# EAGLE schematic chargerDischarger.V6 (EAGLE 9.5.1)
DESIGNER: Juan J. Rojas; INSTITUTION: Kyushu Institute of Technology; PROJECT_NAME: Charger/Discharger; VERSION: 5

## Sheet 1 of 2
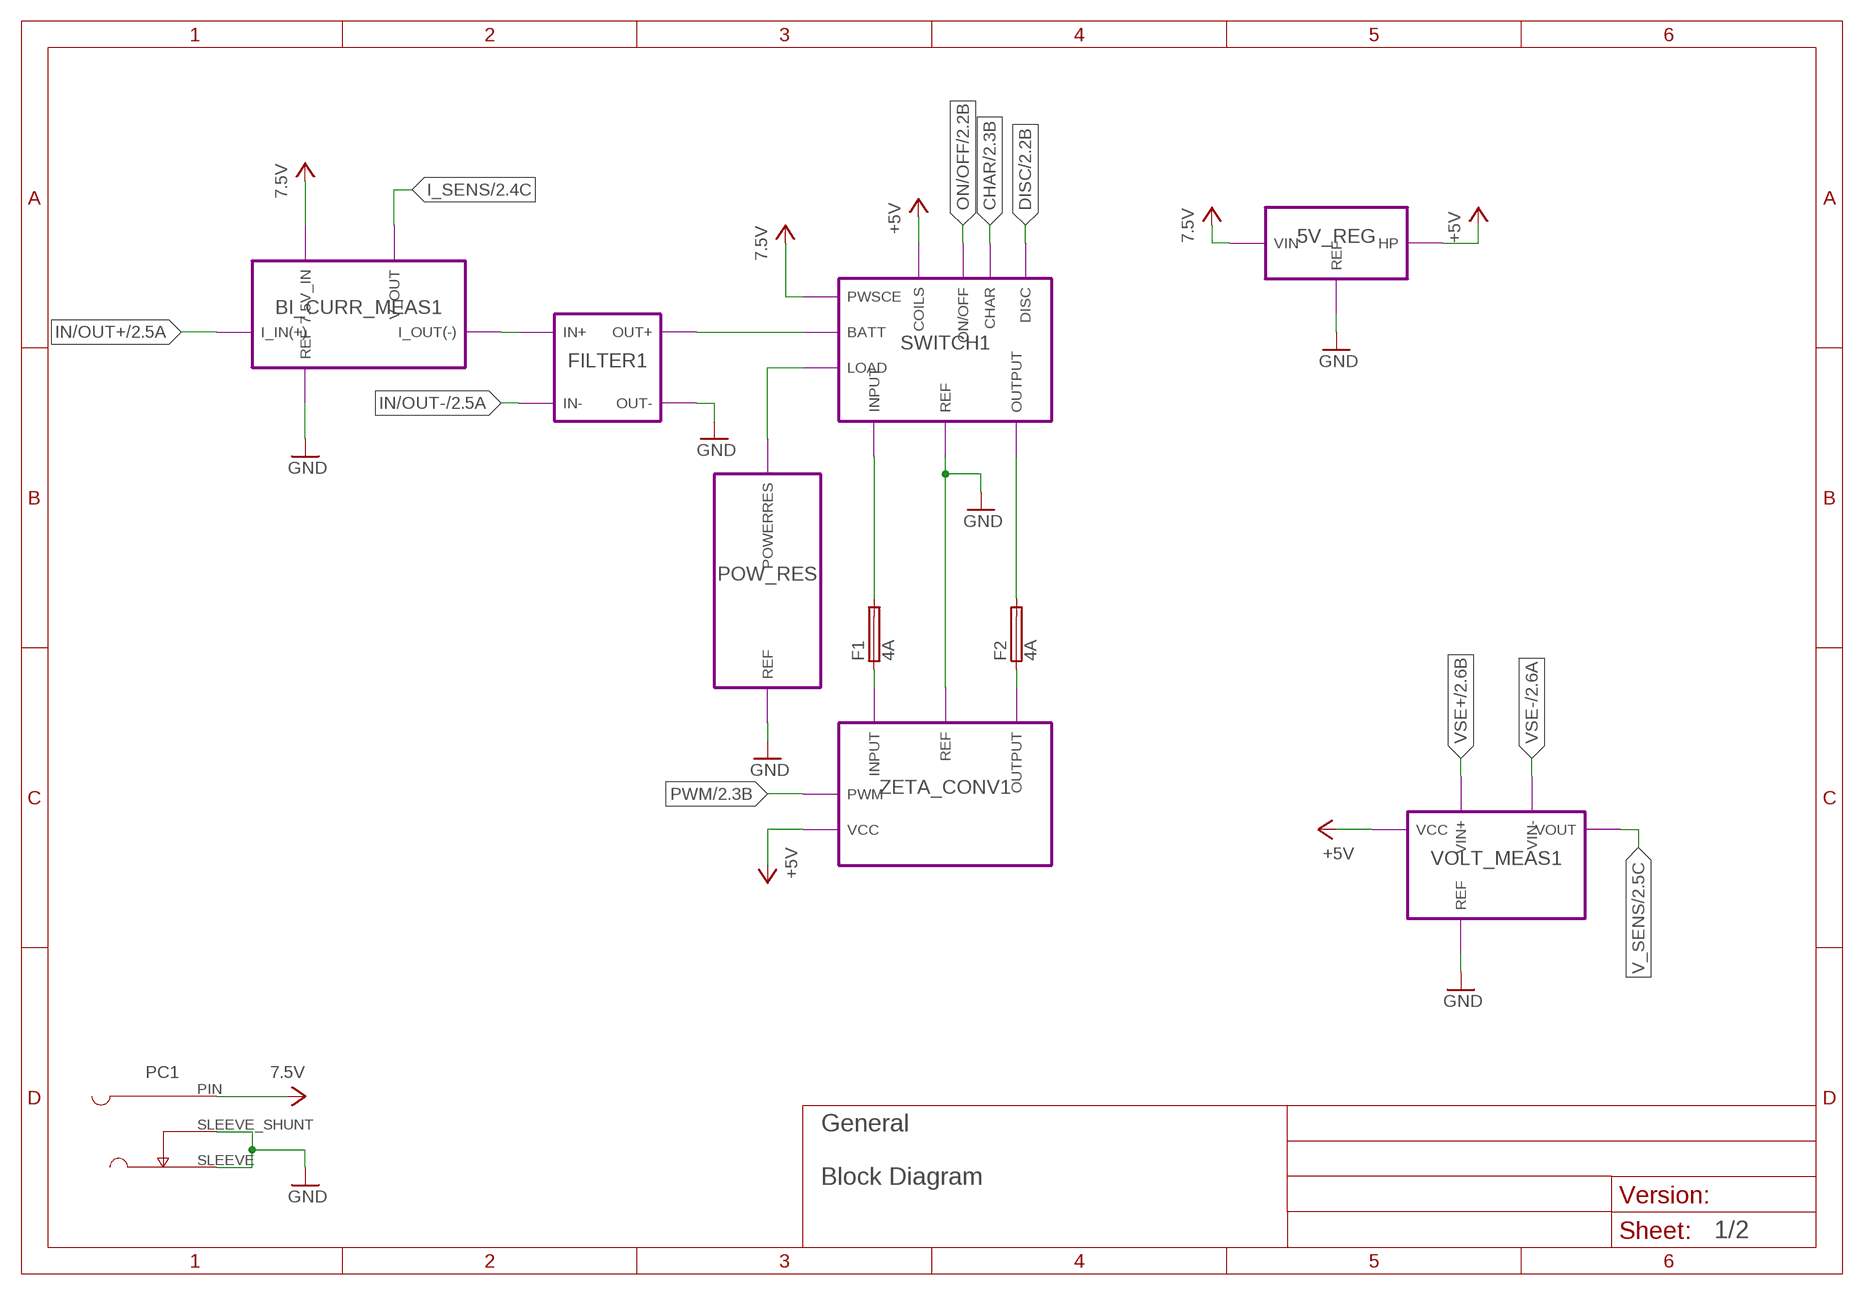
[diagram p0: schematic, sheet 1]
FRAME1 (A4L-JUANJO): SUBTITLE: Block Diagram; TITLE: General

### Parts
F1  4A  FUSEHOLDER  [SH22,5]
F2  4A  FUSEHOLDER  [SH22,5]
PC1  722RA  [722RA]

### Module instances
SWITCH1 = SWITCH (part numbers offset by 100)
ZETA_CONV1 = ZETA_CONVERTER (part numbers offset by 200)
5V_REG = 5V_REGULATION (part numbers offset by 400)
VOLT_MEAS1 = VOLTAGE_MEAS (part numbers offset by 500)
BI_CURR_MEAS1 = BI_CURR_MEAS (part numbers offset by 300)
FILTER1 = FILTER (part numbers offset by 600)
POW_RES = POWER_RESISTOR (part numbers offset by 700)

### Nets
7.5V: PC1.PIN ; port SWITCH1.PWSCE 5V_REG.VIN BI_CURR_MEAS1.7.5V_IN ; also sheet 2
+5V: port SWITCH1.COILS 5V_REG.HP ZETA_CONV1.VCC VOLT_MEAS1.VCC ; also sheet 2
CHAR: port SWITCH1.CHAR ; also sheet 2
DISC: port SWITCH1.DISC ; also sheet 2
GND: PC1.SLEEVE PC1.SLEEVE_SHUNT ; port 5V_REG.REF ZETA_CONV1.REF SWITCH1.REF VOLT_MEAS1.REF BI_CURR_MEAS1.REF FILTER1.OUT- POW_RES.REF ; also sheet 2
I_SENS: port BI_CURR_MEAS1.V_OUT ; also sheet 2
IN/OUT+: port BI_CURR_MEAS1.I_IN(+) ; also sheet 2
IN/OUT-: port FILTER1.IN- ; also sheet 2
N$6: port BI_CURR_MEAS1.I_OUT(-) FILTER1.IN+
N$7: port FILTER1.OUT+ SWITCH1.BATT
N$10: F1.2 ; port SWITCH1.INPUT
N$11: F2.2 ; port SWITCH1.OUTPUT
ON/OFF: port SWITCH1.ON/OFF ; also sheet 2
POWER_RESISTOR: port SWITCH1.LOAD POW_RES.POWERRES
PWM: port ZETA_CONV1.PWM ; also sheet 2
V_SENS: port VOLT_MEAS1.VOUT ; also sheet 2
VSE+: port VOLT_MEAS1.VIN+ ; also sheet 2
VSE-: port VOLT_MEAS1.VIN- ; also sheet 2
ZETA_IN: F1.1 ; port ZETA_CONV1.INPUT
ZETA_OUT: F2.1 ; port ZETA_CONV1.OUTPUT

## Sheet 2 of 2
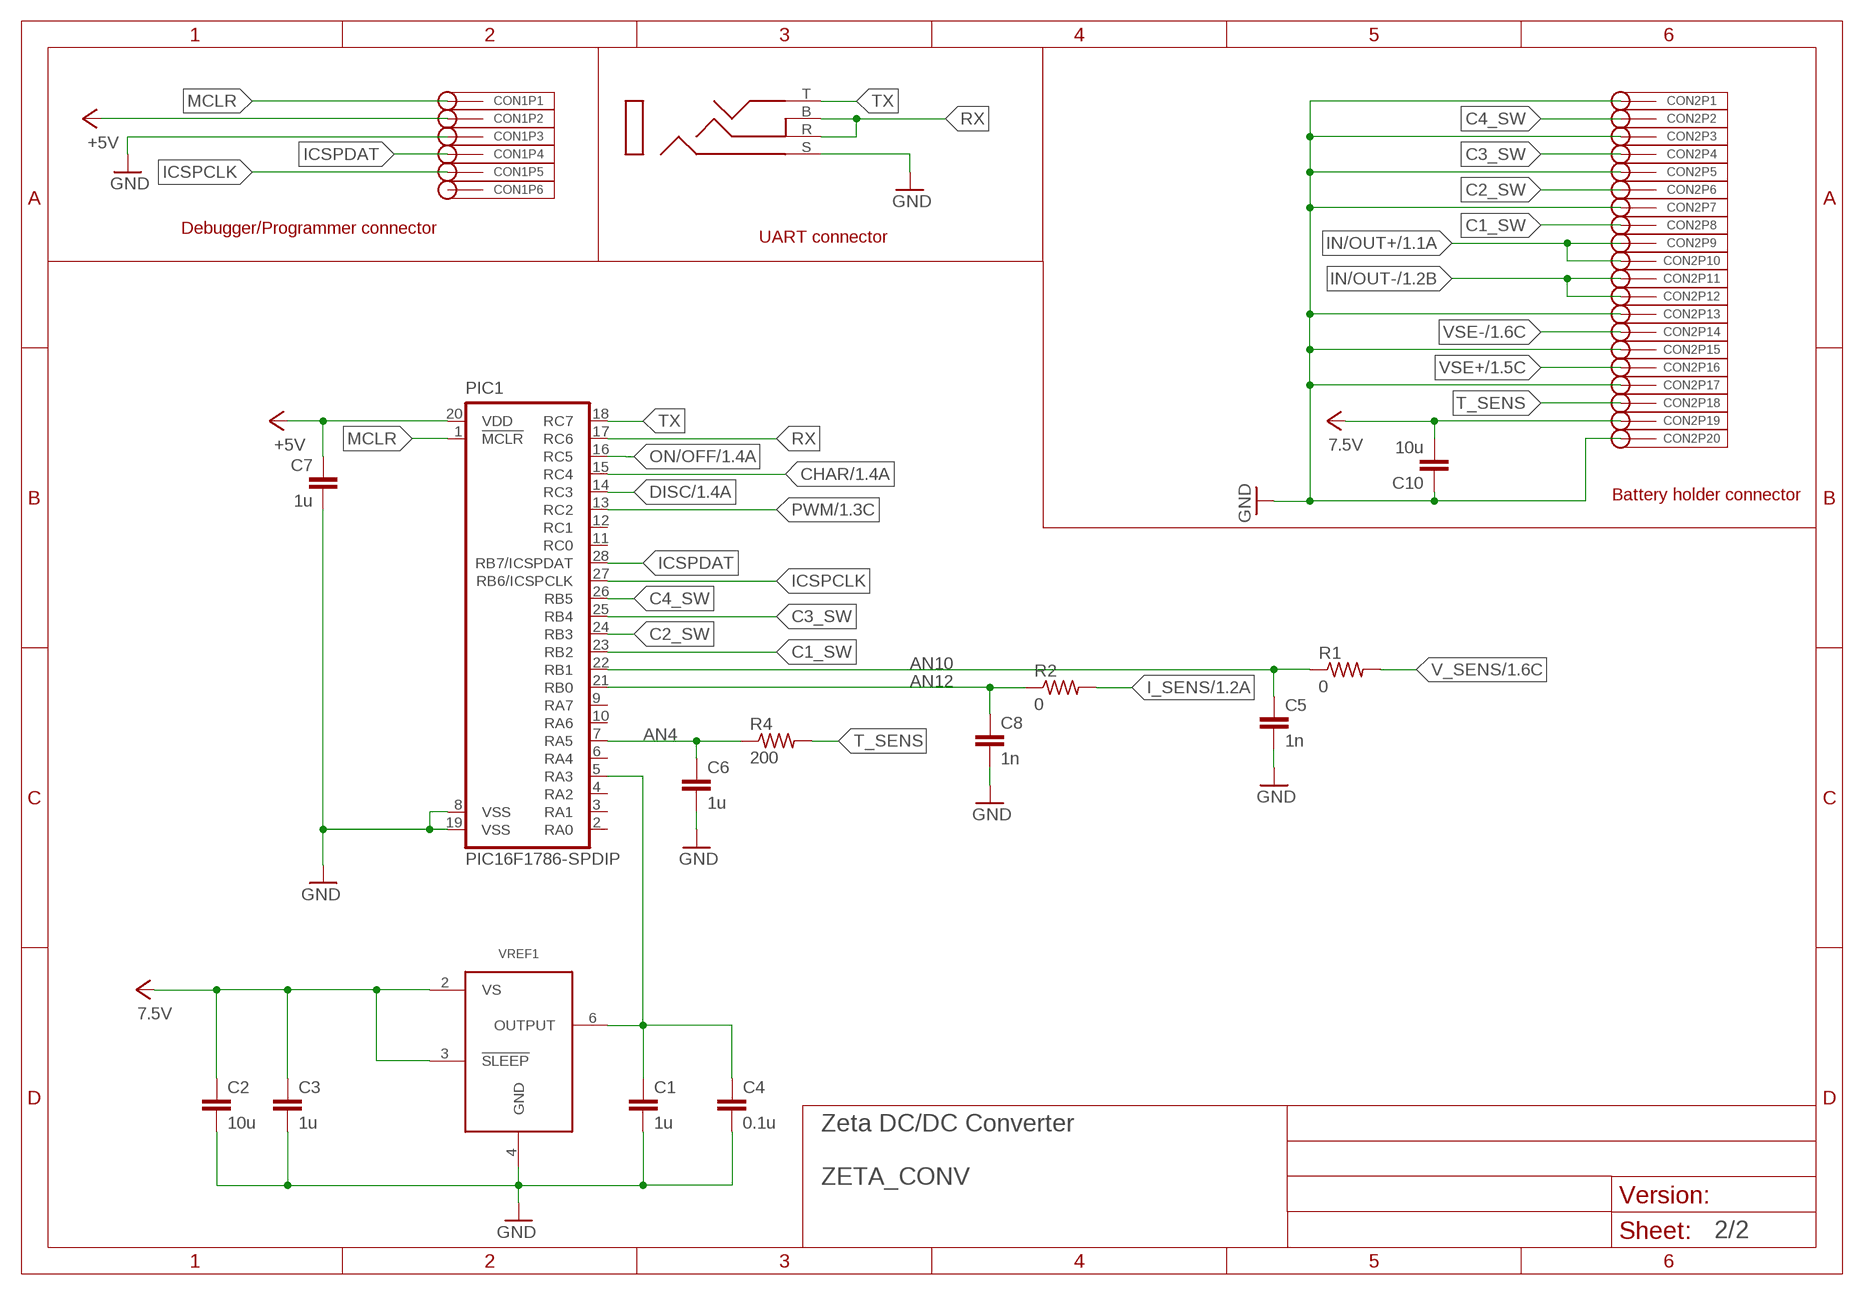
[diagram p1: schematic, sheet 2]
FRAME2 (A4L-JUANJO): SUBTITLE: ZETA_CONV; TITLE: Zeta DC/DC Converter

### Parts
C1  1u  NONPOL_CAP-0603  [C0603]
C2  10u  NONPOL_CAP-0603  [C0603]
C3  1u  NONPOL_CAP-0603  [C0603]
C4  0.1u  NONPOL_CAP-0603  [C0603]
C5  1n  NONPOL_CAP-0603  [C0603]
C6  1u  NONPOL_CAP-0603  [C0603]
C7  1u  NONPOL_CAP-0603  [C0603]
C8  1n  NONPOL_CAP-0603  [C0603]
C10  10u  NONPOL_CAP-0603  [C0603]
COMM  AUDIO_JACK-3.5MM  [KLBR4]
CON1  B6B-EH-A  [B6B-EH-A]
CON2  SQT-110-01-F-D-RA  [SQT-110-01-F-D-RA]
PIC1  PIC16F1786-SPDIP  [SPDIP-28]
R1  0  RESISTOR-0603  [R0603]
R2  0  RESISTOR-0603  [R0603]
R4  200  RESISTOR-0603  [R0603]
VREF1  REF195GSZ  [SOIC-8]

### Nets
7.5V: C2.1 C3.1 C10.2 CON2.19 VREF1.2(VS) VREF1.3(!SLEEP!) ; also sheet 1
+5V: C7.1 CON1.2 PIC1.20(VDD) ; also sheet 1
C1_SW: CON2.8 PIC1.23(RB2)
C2_SW: CON2.6 PIC1.24(RB3)
C3_SW: CON2.4 PIC1.25(RB4)
C4_SW: CON2.2 PIC1.26(RB5)
CHAR: PIC1.15(RC4) ; also sheet 1
DISC: PIC1.14(RC3) ; also sheet 1
GND: C1.2 C2.2 C3.2 C4.2 C5.2 C6.2 C7.2 C8.2 C10.1 COMM.S CON1.3 CON2.1 CON2.3 CON2.5 CON2.7 CON2.13 CON2.15 CON2.17 CON2.20 PIC1.8(VSS) PIC1.19(VSS) VREF1.4(GND) ; also sheet 1
I_SENS: R2.2 ; also sheet 1
ICSPCLK: CON1.5 PIC1.27(RB6/ICSPCLK)
ICSPDAT: CON1.4 PIC1.28(RB7/ICSPDAT)
IN/OUT+: CON2.9 CON2.10 ; also sheet 1
IN/OUT-: CON2.11 CON2.12 ; also sheet 1
MCLR: CON1.1 PIC1.1(!MCLR)
N$1: C8.1 PIC1.21(RB0) R2.1
N$2: C5.1 PIC1.22(RB1) R1.1
N$3: C6.1 PIC1.7(RA5) R4.1
N$4: C1.1 C4.1 PIC1.5(RA3) VREF1.6(OUTPUT)
ON/OFF: PIC1.16(RC5) ; also sheet 1
PWM: PIC1.13(RC2) ; also sheet 1
RX: COMM.B COMM.R PIC1.17(RC6)
T_SENS: CON2.18 R4.2
TX: COMM.T PIC1.18(RC7)
V_SENS: R1.2 ; also sheet 1
VSE+: CON2.16 ; also sheet 1
VSE-: CON2.14 ; also sheet 1
Unconnected: CON1.6 PIC1.2(RA0) PIC1.3(RA1) PIC1.4(RA2) PIC1.6(RA4) PIC1.9(RA7) PIC1.10(RA6) PIC1.11(RC0) PIC1.12(RC1)

### Notes on the sheet
- Debugger/Programmer connector
- UART connector
- Battery holder connector
- AN10
- AN12
- AN4

## Library data of the parts
C1-C8 C10 = Pasives:NONPOL_CAP
COMM = Interfaces:AUDIO_JACK-3.5MM
CON1 = Interfaces:B6B-EH-A
CON2 = Interfaces:SQT-110-01-F-D-RA
F1 F2 = Pasives:FUSEHOLDER: FUSE HOLDER grid 22,5 mm, OGN0031 8201, Schurter (Buerklin); MF: SCHURTER; MPN: 0031.8201
PC1 = Interfaces:722RA
PIC1 = ICs:PIC16F1786
R1 R2 R4 = Pasives:RESISTOR: RESISTOR
VREF1 = ICs:REF195GSZ

## Module ZETA_CONVERTER
Ports: INPUT(io) OUTPUT(io) REF(io) PWM(io) VCC(io)
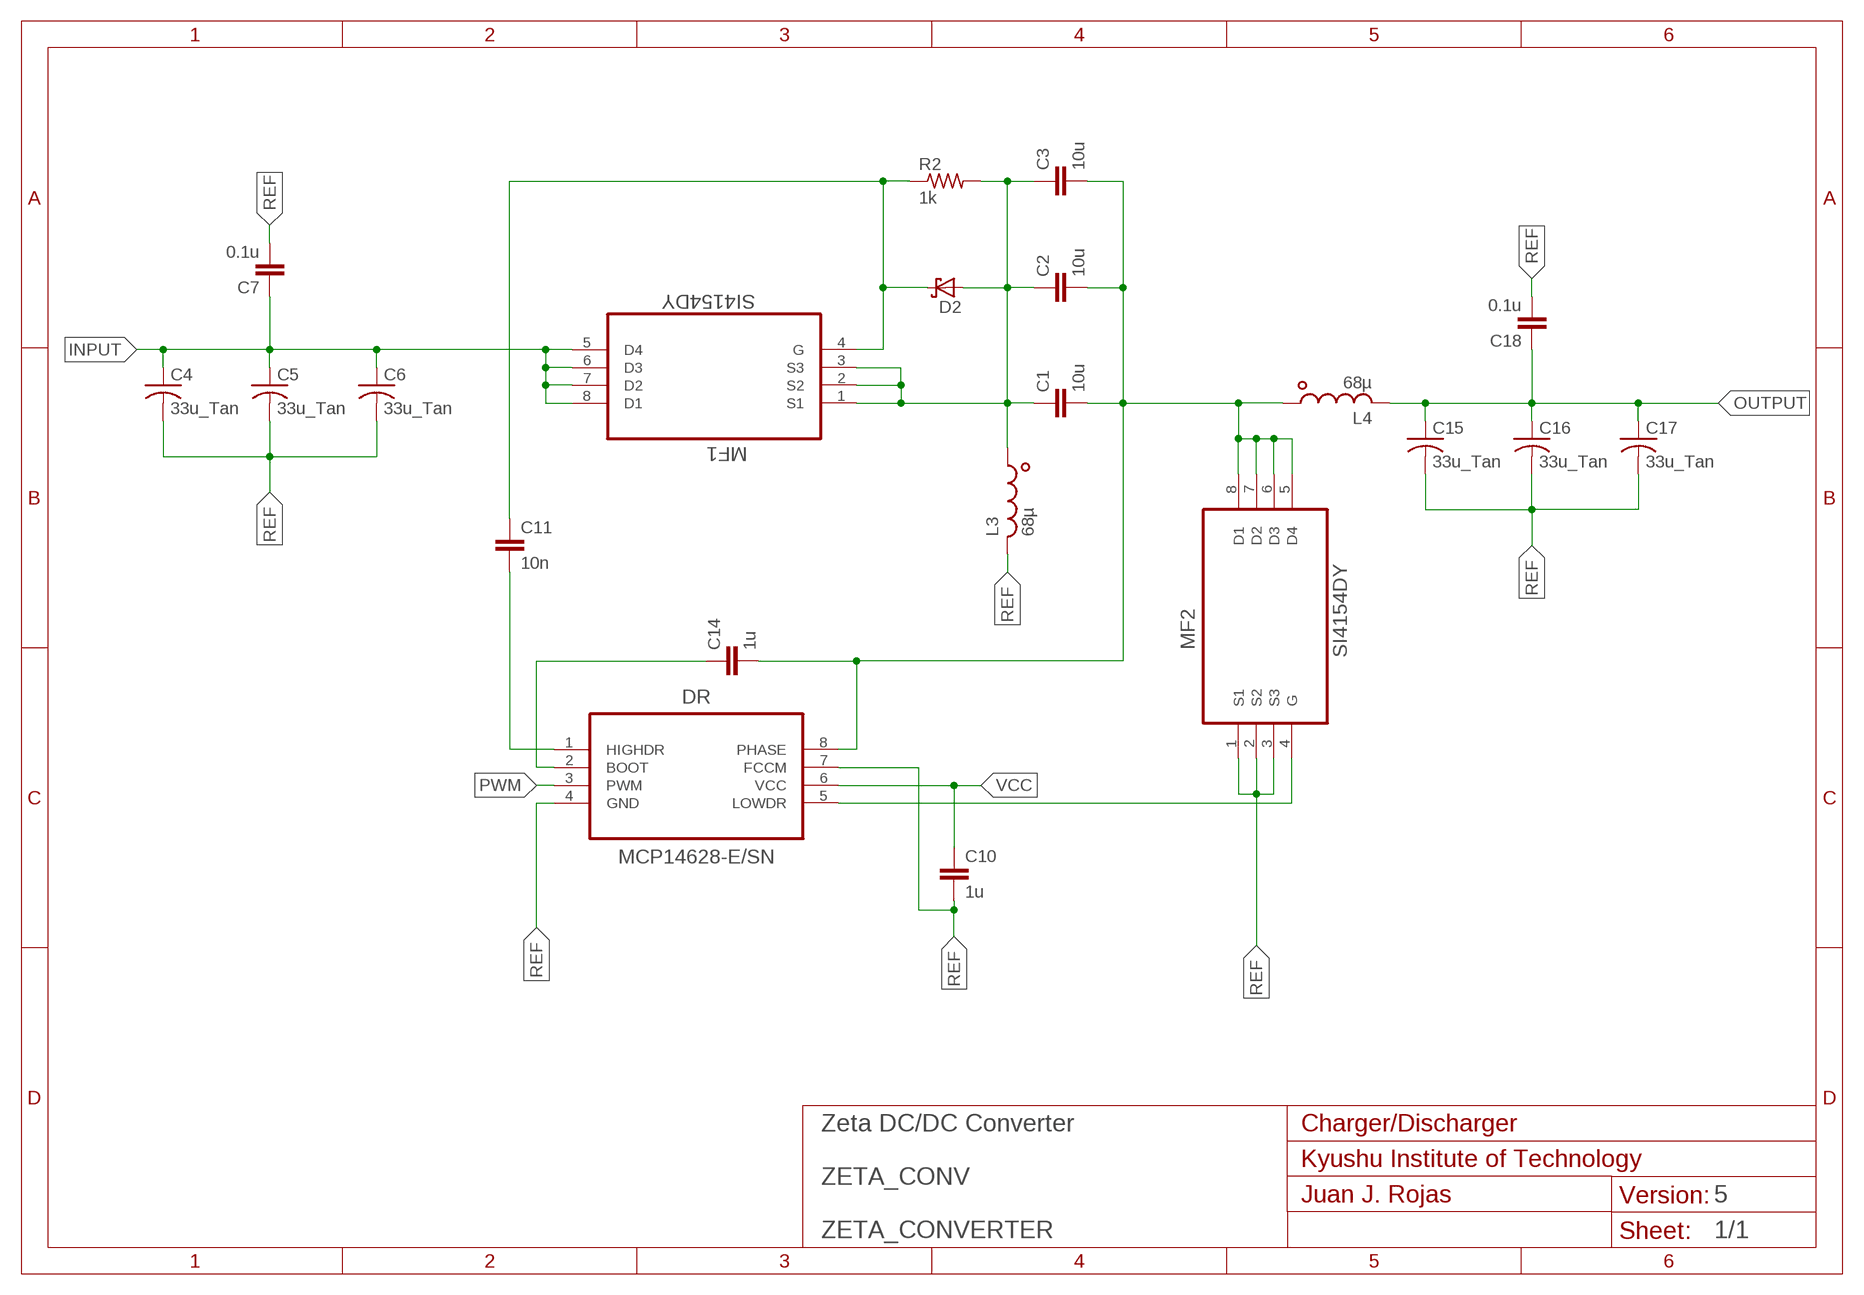
[diagram p2: schematic, module ZETA_CONVERTER, sheet 1]
FRAME2 (A4L-JUANJO): SUBTITLE: ZETA_CONV; TITLE: Zeta DC/DC Converter

### Parts
C1  10u  NONPOL_CAP-1210  [C1210]
C2  10u  NONPOL_CAP-1210  [C1210]
C3  10u  NONPOL_CAP-1210  [C1210]
C4  33u_Tan  POL_CAP-7343  [C7343]
C5  33u_Tan  POL_CAP-7343  [C7343]
C6  33u_Tan  POL_CAP-7343  [C7343]
C7  0.1u  NONPOL_CAP-0603  [C0603]
C10  1u  NONPOL_CAP-0603  [C0603]
C11  10n  NONPOL_CAP-0603  [C0603]
C14  1u  NONPOL_CAP-0603  [C0603]
C15  33u_Tan  POL_CAP-7343  [C7343]
C16  33u_Tan  POL_CAP-7343  [C7343]
C17  33u_Tan  POL_CAP-7343  [C7343]
C18  0.1u  NONPOL_CAP-0603  [C0603]
D2  SCHOTTKY_DIODE-BAT42W  [SOD123]
DR  MCP14628-E/SN  [SOIC-8]
L3  68µ  INDUCTOR-60B8683C  [60B683C]
L4  68µ  INDUCTOR-60B8683C  [60B683C]
MF1  SI4154DY  [SOIC-8]
MF2  SI4154DY  [SOIC-8]
R2  1k  RESISTOR-0603  [R0603]

### Nets
INPUT: C4.+ C5.+ C6.+ C7.1 MF1.5(D4) MF1.6(D3) MF1.7(D2) MF1.8(D1)
L1_IN1: C1.1 C2.1 C3.1 D2.A L3.1 MF1.1(S1) MF1.2(S2) MF1.3(S3) R2.2
L2_IN1: C1.2 C2.2 C3.2 C14.2 DR.8(PHASE) L4.1 MF2.5(D4) MF2.6(D3) MF2.7(D2) MF2.8(D1)
N$10: DR.5(LOWDR) MF2.4(G)
N$28: C14.1 DR.2(BOOT)
N$29: C11.2 DR.1(HIGHDR)
N$30: C11.1 D2.C MF1.4(G) R2.1
OUTPUT: C15.+ C16.+ C17.+ C18.1 L4.2
PWM: DR.3(PWM)
REF: C4.- C5.- C6.- C7.2 C10.2 C15.- C16.- C17.- C18.2 DR.4(GND) DR.7(FCCM) L3.2 MF2.1(S1) MF2.2(S2) MF2.3(S3)
VCC: C10.1 DR.6(VCC)

### Library data of the parts
C1 C3 C7 C10 C11 C14 C18 = Pasives:NONPOL_CAP
C2 = Pasives:NONPOL_CAP; SPICEPREFIX: C
C4-C6 C15-C17 = Pasives:POL_CAP
D2 = Pasives:SCHOTTKY_DIODE: BAT42W
DR = ICs:MCP14628-E/SN: MOSFET DRIVER, 2A, SYNC BUCK
L3 L4 = Pasives:INDUCTOR: SMD Power Inductor
MF1 MF2 = ICs:SI4154DY: N-Channel 40-V (D-S) MOSFET
R2 = Pasives:RESISTOR: RESISTOR

## Module SWITCH
Ports: OUTPUT(io) INPUT(io) REF(io) BATT(io) COILS(io) PWSCE(io) LOAD(io) CHAR(io) DISC(io) ON/OFF(io)
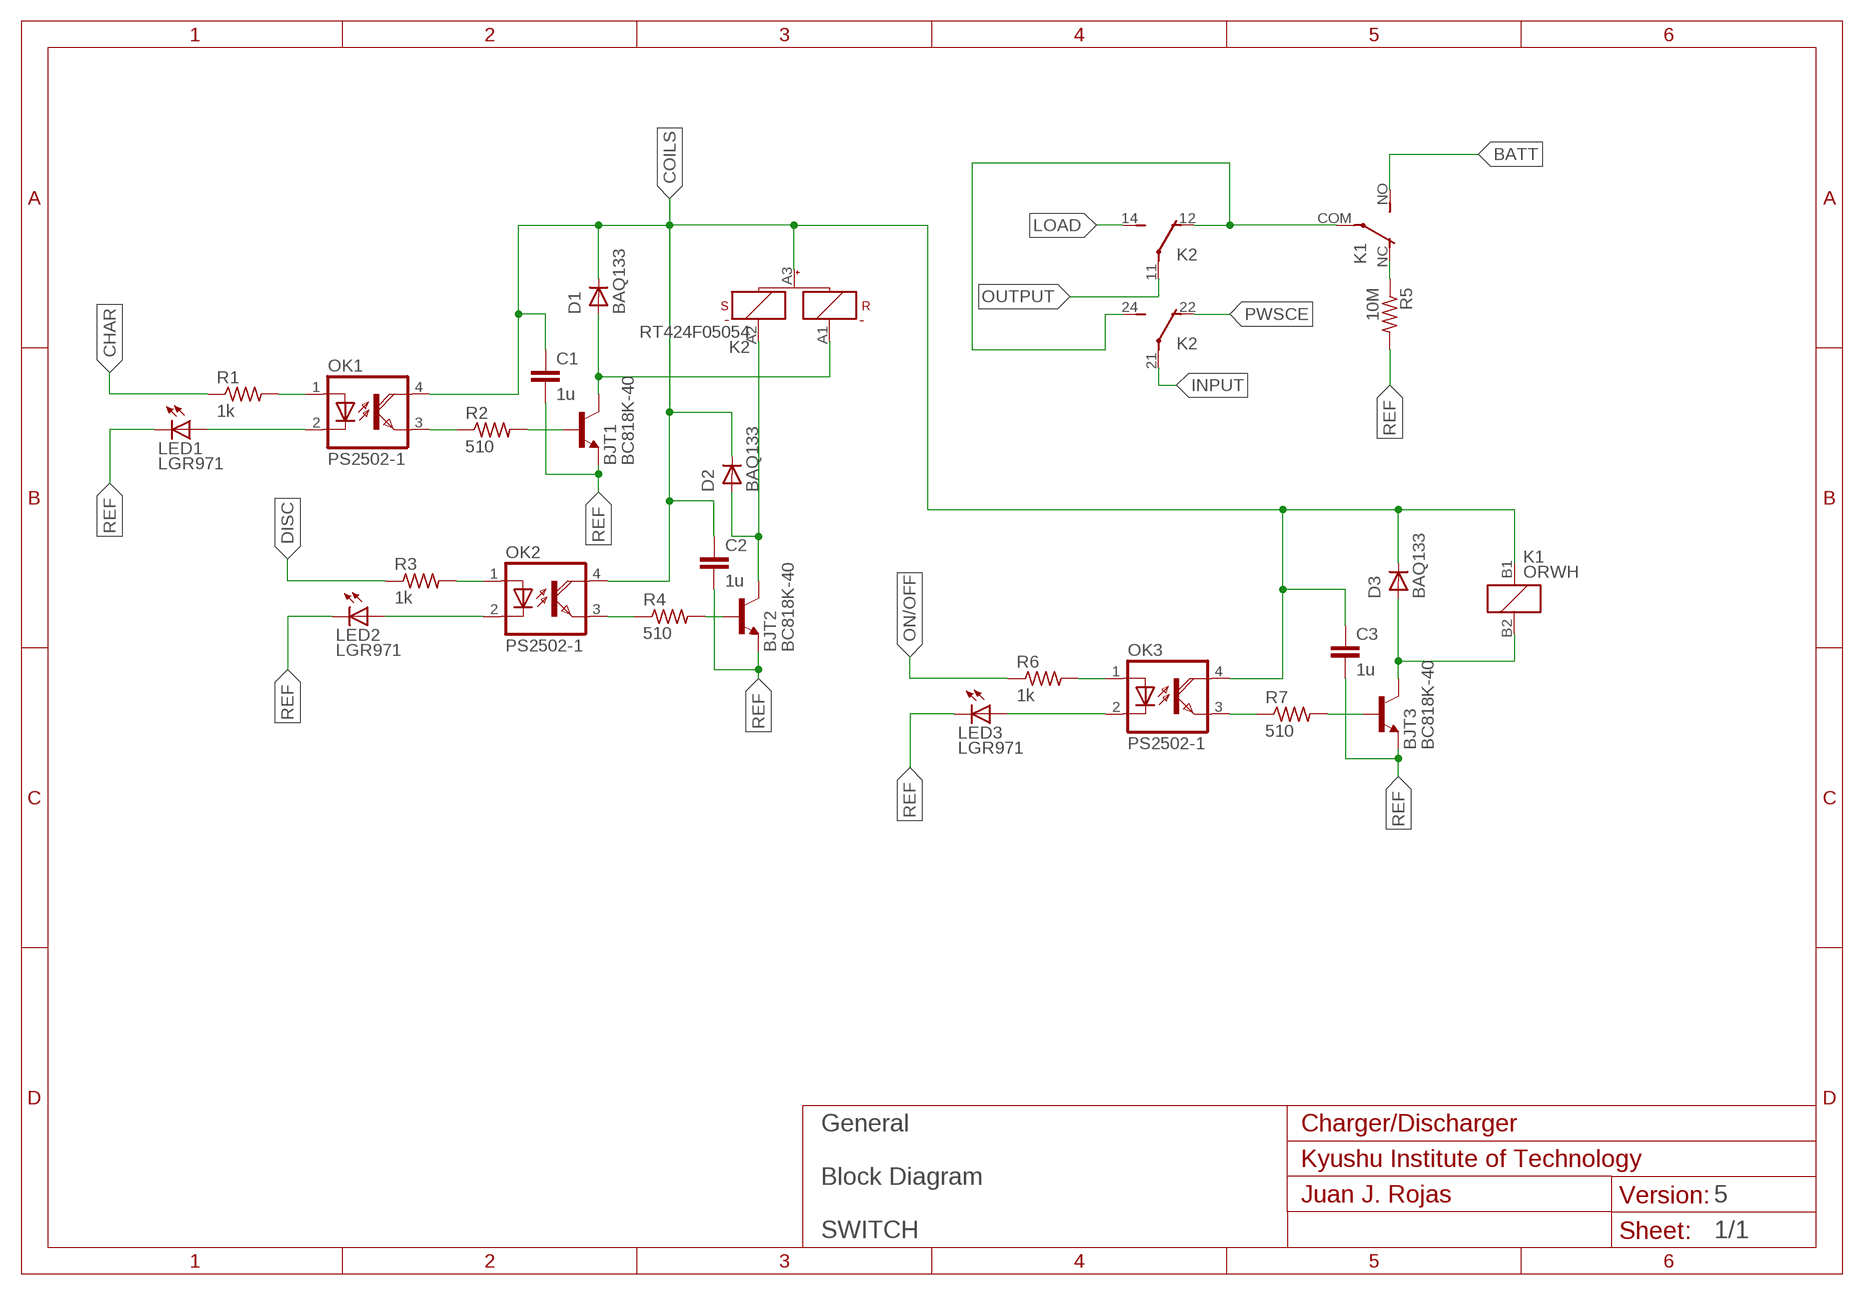
[diagram p3: schematic, module SWITCH, sheet 1]
FRAME2 (A4L-JUANJO): SUBTITLE: Block Diagram; TITLE: General

### Parts
BJT1  BC818K-40  [SOT-23]
BJT2  BC818K-40  [SOT-23]
BJT3  BC818K-40  [SOT-23]
C1  1u  NONPOL_CAP-0603  [C0603]
C2  1u  NONPOL_CAP-0603  [C0603]
C3  1u  NONPOL_CAP-0603  [C0603]
D1  BAQ133  DIODE-BAQ133-GS08  [SOD08]
D2  BAQ133  DIODE-BAQ133-GS08  [SOD08]
D3  BAQ133  DIODE-BAQ133-GS08  [SOD08]
K1  ORWH  [ORWH-SS-105D1F]
K2  RT424F05054  [RT424F05]
LED1  LGR971  [SML0805]
LED2  LGR971  [SML0805]
LED3  LGR971  [SML0805]
OK1  PS2502-1  [DIL04]
OK2  PS2502-1  [DIL04]
OK3  PS2502-1  [DIL04]
R1  1k  RESISTOR-0603  [R0603]
R2  510  RESISTOR-0603  [R0603]
R3  1k  RESISTOR-0603  [R0603]
R4  510  RESISTOR-0603  [R0603]
R5  10M  RESISTOR-0603  [R0603]
R6  1k  RESISTOR-0603  [R0603]
R7  510  RESISTOR-0603  [R0603]

### Nets
BATT: K1.NO
CHAR: R1.1
COILS: C1.1 C2.1 C3.1 D1.C D2.C D3.C K1.B1 K2.A3(1:-) OK1.4(COL) OK2.4(COL) OK3.4(COL)
DISC: R3.1
INPUT: K2.21(3:P)
LOAD: K2.14(2:S)
N$1: BJT1.1(B) R2.2
N$2: BJT1.3(C) D1.A K2.A1(1:S+)
N$3: LED2.A OK2.2(C)
N$4: OK2.1(A) R3.2
N$5: OK2.3(EMI) R4.1
N$6: BJT2.1(B) R4.2
N$7: BJT2.3(C) D2.A K2.A2(1:R+)
N$8: K1.NC R5.1
N$9: LED3.A OK3.2(C)
N$10: OK3.1(A) R6.2
N$11: LED1.A OK1.2(C)
N$12: OK1.1(A) R1.2
N$13: OK1.3(EMI) R2.1
N$14: OK3.3(EMI) R7.1
N$15: BJT3.1(B) R7.2
N$16: BJT3.3(C) D3.A K1.B2
ON/OFF: R6.1
OUTPUT: K2.11(2:P)
PWSCE: K2.22(3:O)
REF: BJT1.2(E) BJT2.2(E) BJT3.2(E) C1.2 C2.2 C3.2 LED1.C LED2.C LED3.C R5.2
TEST: K1.COM K2.12(2:O) K2.24(3:S)

### Library data of the parts
BJT1-BJT3 = ICs:BC818K-40
C1-C3 = Pasives:NONPOL_CAP
D1-D3 = Pasives:DIODE
K1 = Electromechanical:ORWH: Power PCB Relay 10A, 5V
K2 = Electromechanical:RT424F05: Power PCB Relay polarized bistable version SCHRACK 2 pole 8 A Source: http://www.schrack.com/.. 5843.pdf; OC_FARNELL: unknown; OC_NEWARK: unknown
LED1-LED3 = Pasives:LGR971
OK1-OK3 = ICs:PS2502-1: PS2502-1
R1-R7 = Pasives:RESISTOR: RESISTOR

## Module 5V_REGULATION
Ports: VIN(io) REF(io) HP(io)
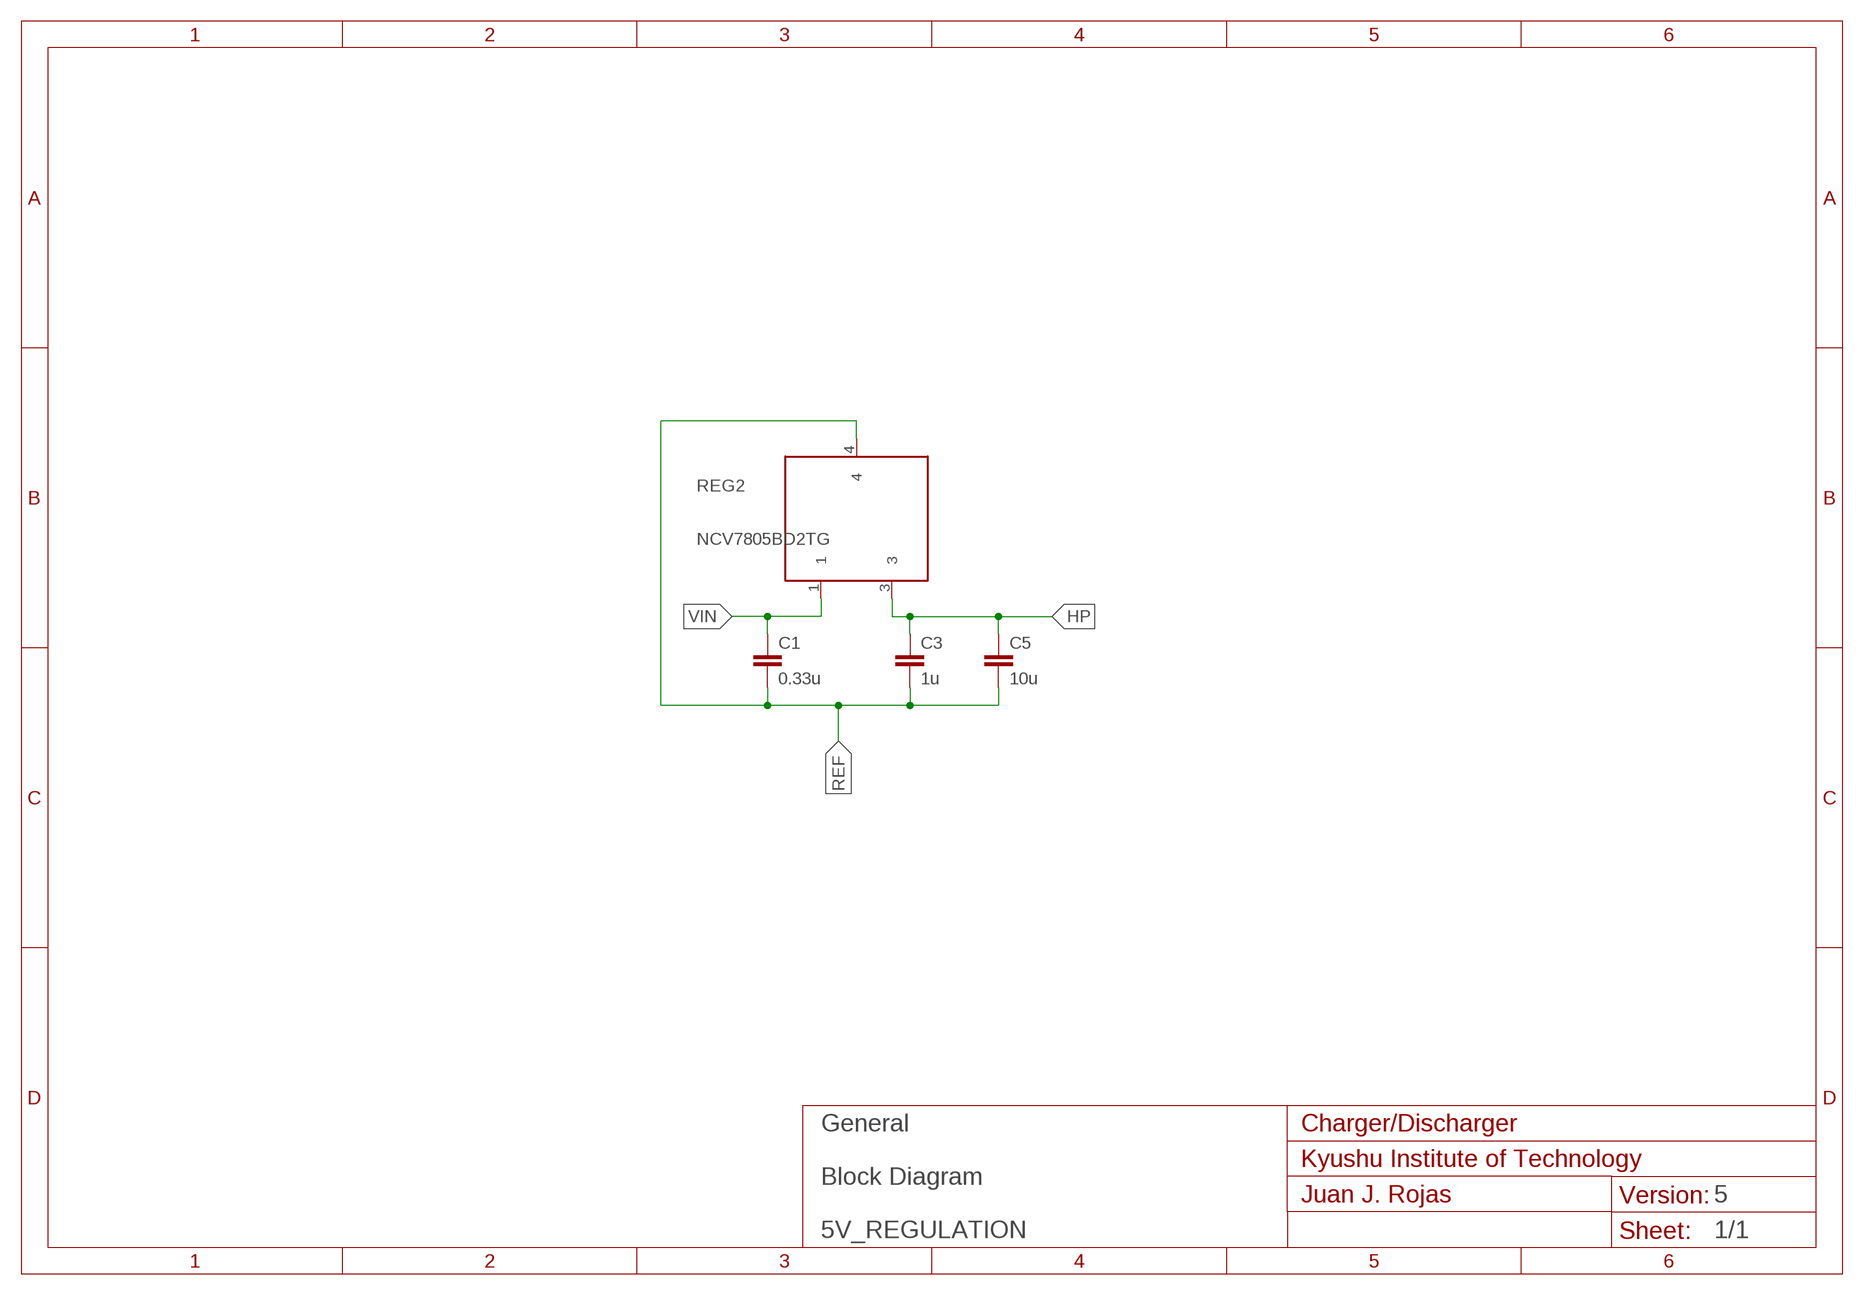
[diagram p4: schematic, module 5V_REGULATION, sheet 1]
FRAME2 (A4L-JUANJO): SUBTITLE: Block Diagram; TITLE: General

### Parts
C1  0.33u  NONPOL_CAP-0603  [C0603]
C3  1u  NONPOL_CAP-0603  [C0603]
C5  10u  NONPOL_CAP-0603  [C0603]
REG2  NCV7805BD2TG  [D2PAK-3]

### Nets
HP: C3.1 C5.1 REG2.3
REF: C1.2 C3.2 C5.2 REG2.4
VIN: C1.1 REG2.1

### Library data of the parts
C1 C3 C5 = Pasives:NONPOL_CAP
REG2 = ICs:NCV7805BD2TG

## Module VOLTAGE_MEAS
Ports: REF(io) VOUT(io) VCC(io) VIN+(io) VIN-(io)
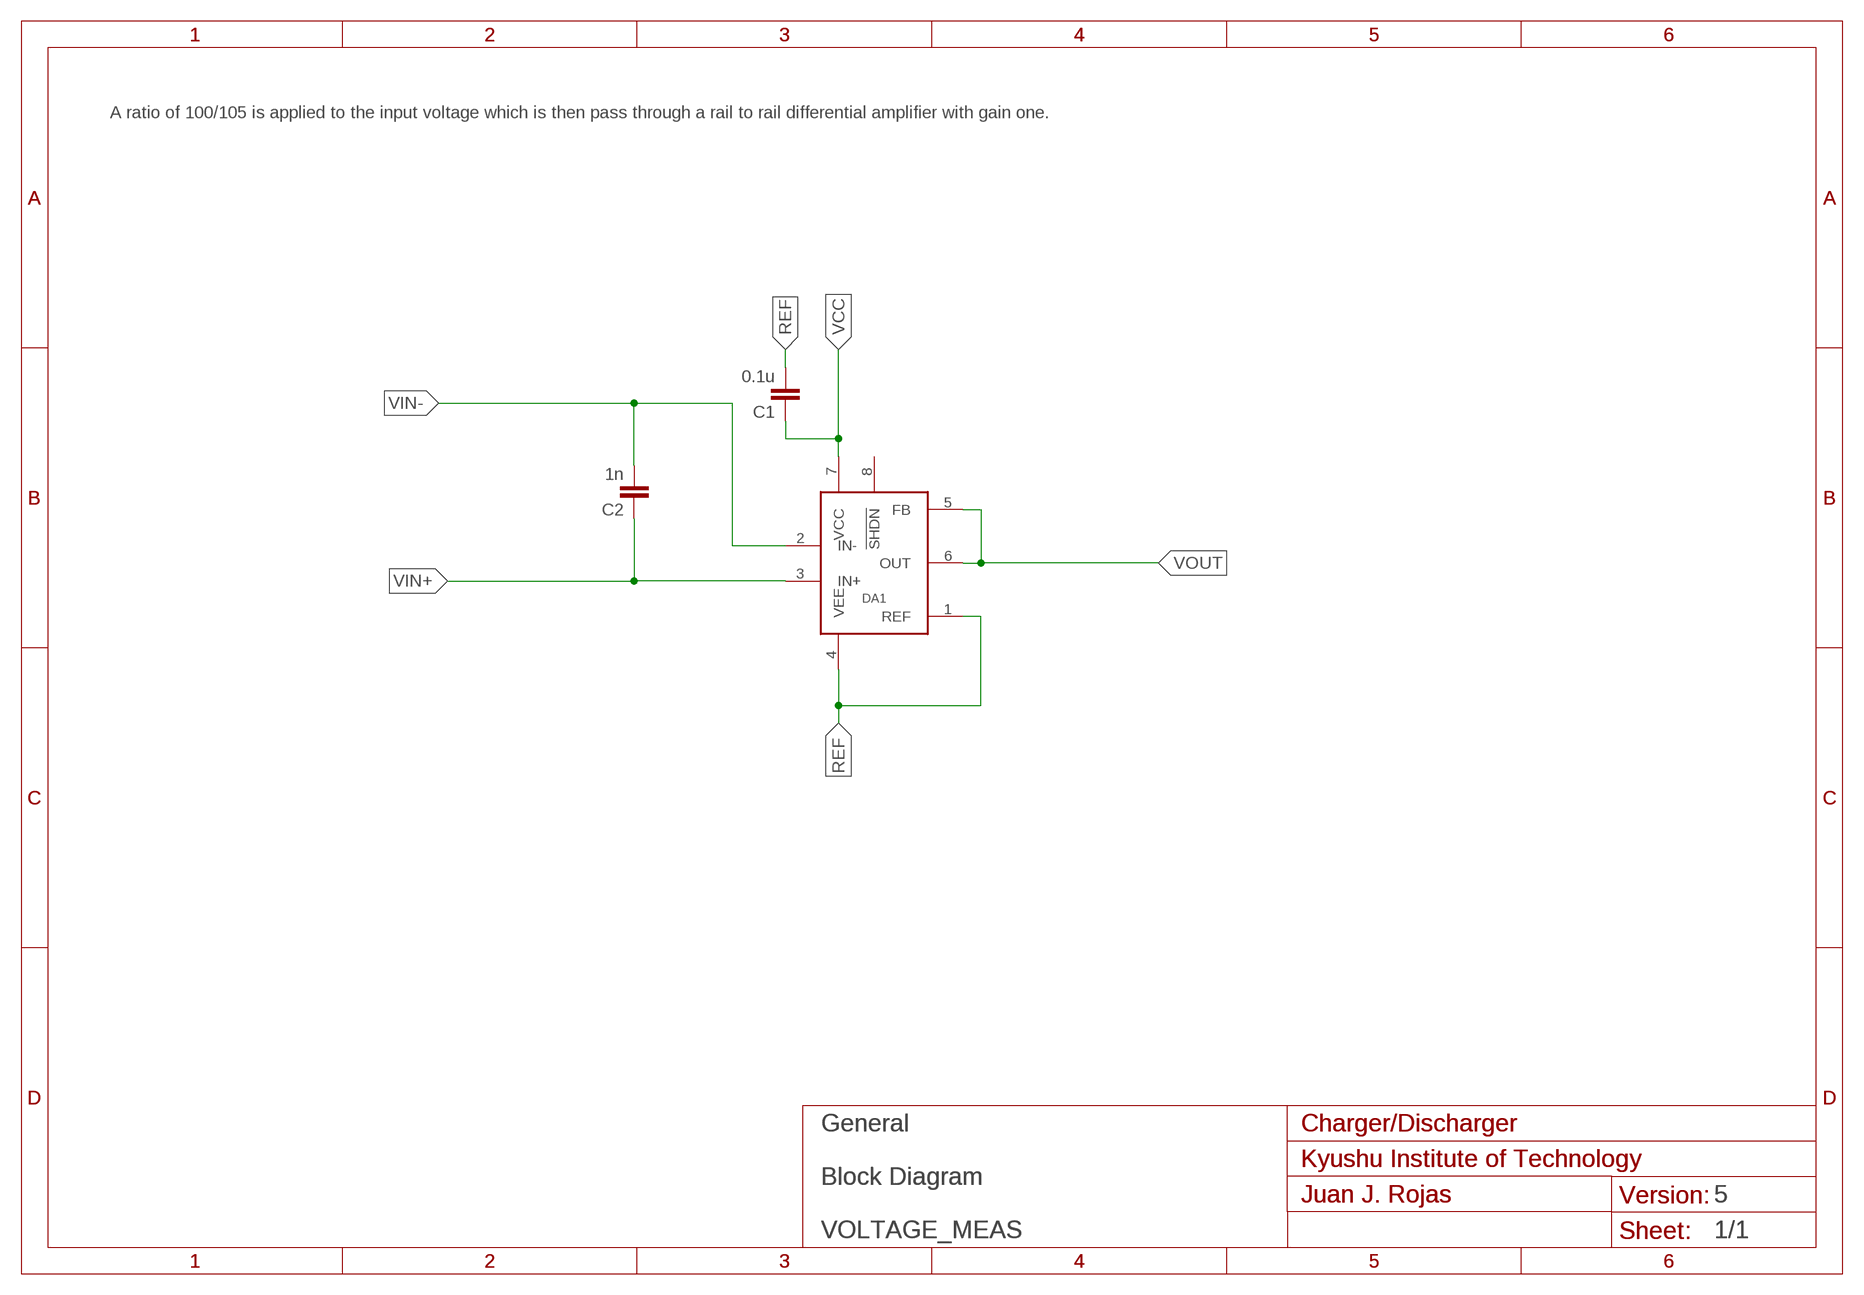
[diagram p5: schematic, module VOLTAGE_MEAS, sheet 1]
FRAME1 (A4L-JUANJO): SUBTITLE: Block Diagram; TITLE: General
FRAME2 (A4L-JUANJO): SUBTITLE: Block Diagram; TITLE: General

### Parts
C1  0.1u  NONPOL_CAP-0603  [C0603]
C2  1n  NONPOL_CAP-0603  [C0603]
DA1  MAX4198  [SOIC-8]

### Nets
REF: C1.2 DA1.1(REF) DA1.4(VEE)
VCC: C1.1 DA1.7(VCC)
VIN+: C2.1 DA1.3(IN+)
VIN-: C2.2 DA1.2(IN-)
VOUT: DA1.5(FB) DA1.6(OUT)
Unconnected: DA1.8(!SHDN!)

### Notes on the sheet
- A ratio of 100/105 is applied to the input voltage which is then pass through a rail to rail differential amplifier with gain one.

### Library data of the parts
C1 C2 = Pasives:NONPOL_CAP
DA1 = ICs:MAX4198

## Module BI_CURR_MEAS
Ports: I_IN(+)(io) I_OUT(-)(io) REF(io) V_OUT(io) 7.5V_IN(io)
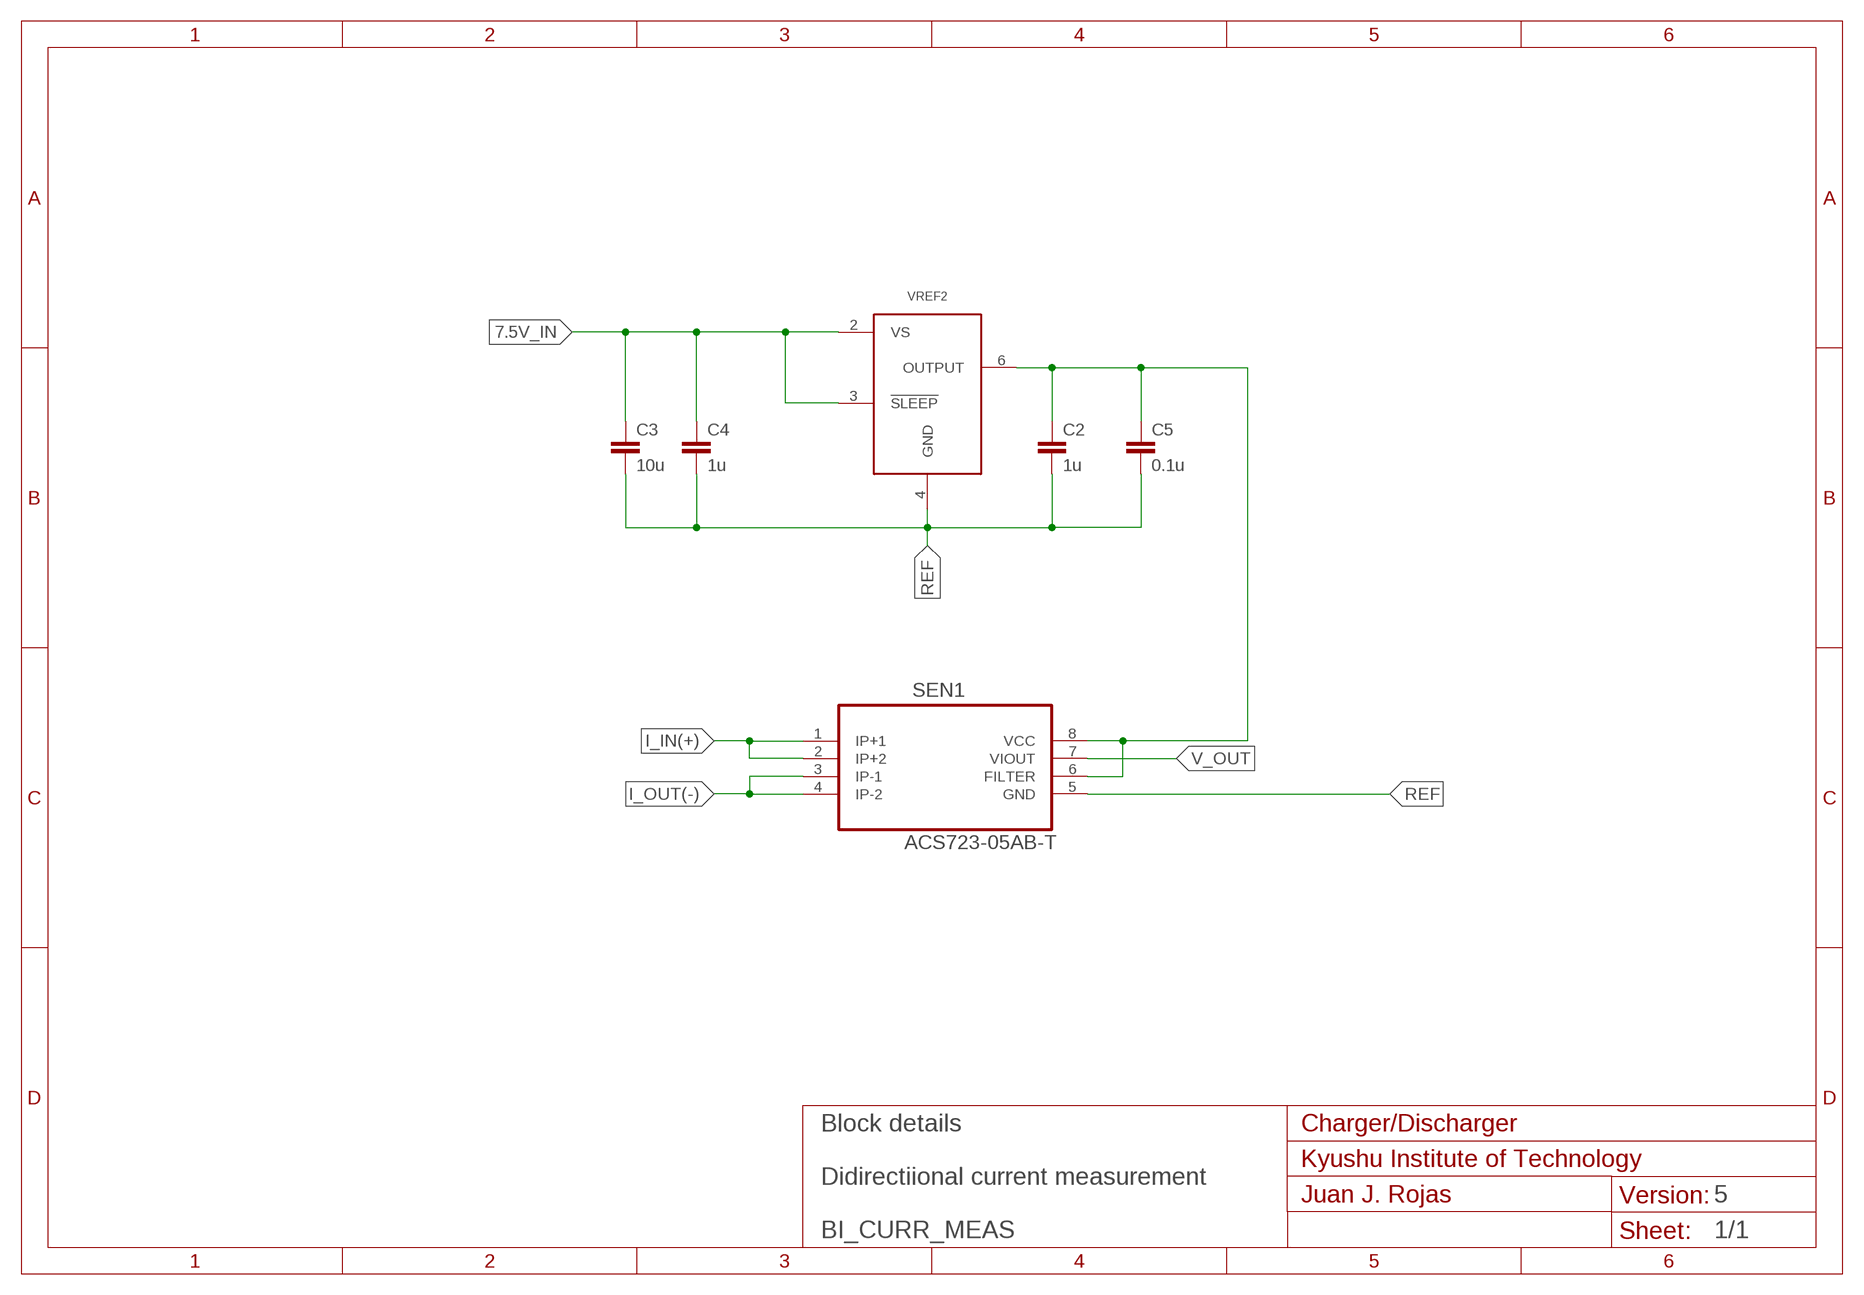
[diagram p6: schematic, module BI_CURR_MEAS, sheet 1]
FRAME2 (A4L-JUANJO): SUBTITLE: Didirectiional current measurement; TITLE: Block details

### Parts
C2  1u  NONPOL_CAP-0603  [C0603]
C3  10u  NONPOL_CAP-0603  [C0603]
C4  1u  NONPOL_CAP-0603  [C0603]
C5  0.1u  NONPOL_CAP-0603  [C0603]
SEN1  ACS723-05AB-T  [SOIC-8]
VREF2  REF195GSZ  [SOIC-8]

### Nets
7.5V_IN: C3.1 C4.1 VREF2.2(VS) VREF2.3(!SLEEP!)
I_IN(+): SEN1.1(IP+1) SEN1.2(IP+2)
I_OUT(-): SEN1.3(IP-1) SEN1.4(IP-2)
N$1: C2.1 C5.1 SEN1.6(FILTER) SEN1.8(VCC) VREF2.6(OUTPUT)
REF: C2.2 C3.2 C4.2 C5.2 SEN1.5(GND) VREF2.4(GND)
V_OUT: SEN1.7(VIOUT)

### Library data of the parts
C2-C5 = Pasives:NONPOL_CAP
SEN1 = ICs:ACS723-05AB-T: Hall Effect-Based Linear Current Sensor IC - 5A
VREF2 = ICs:REF195GSZ

## Module FILTER
Ports: IN+(io) IN-(io) OUT+(io) OUT-(io)
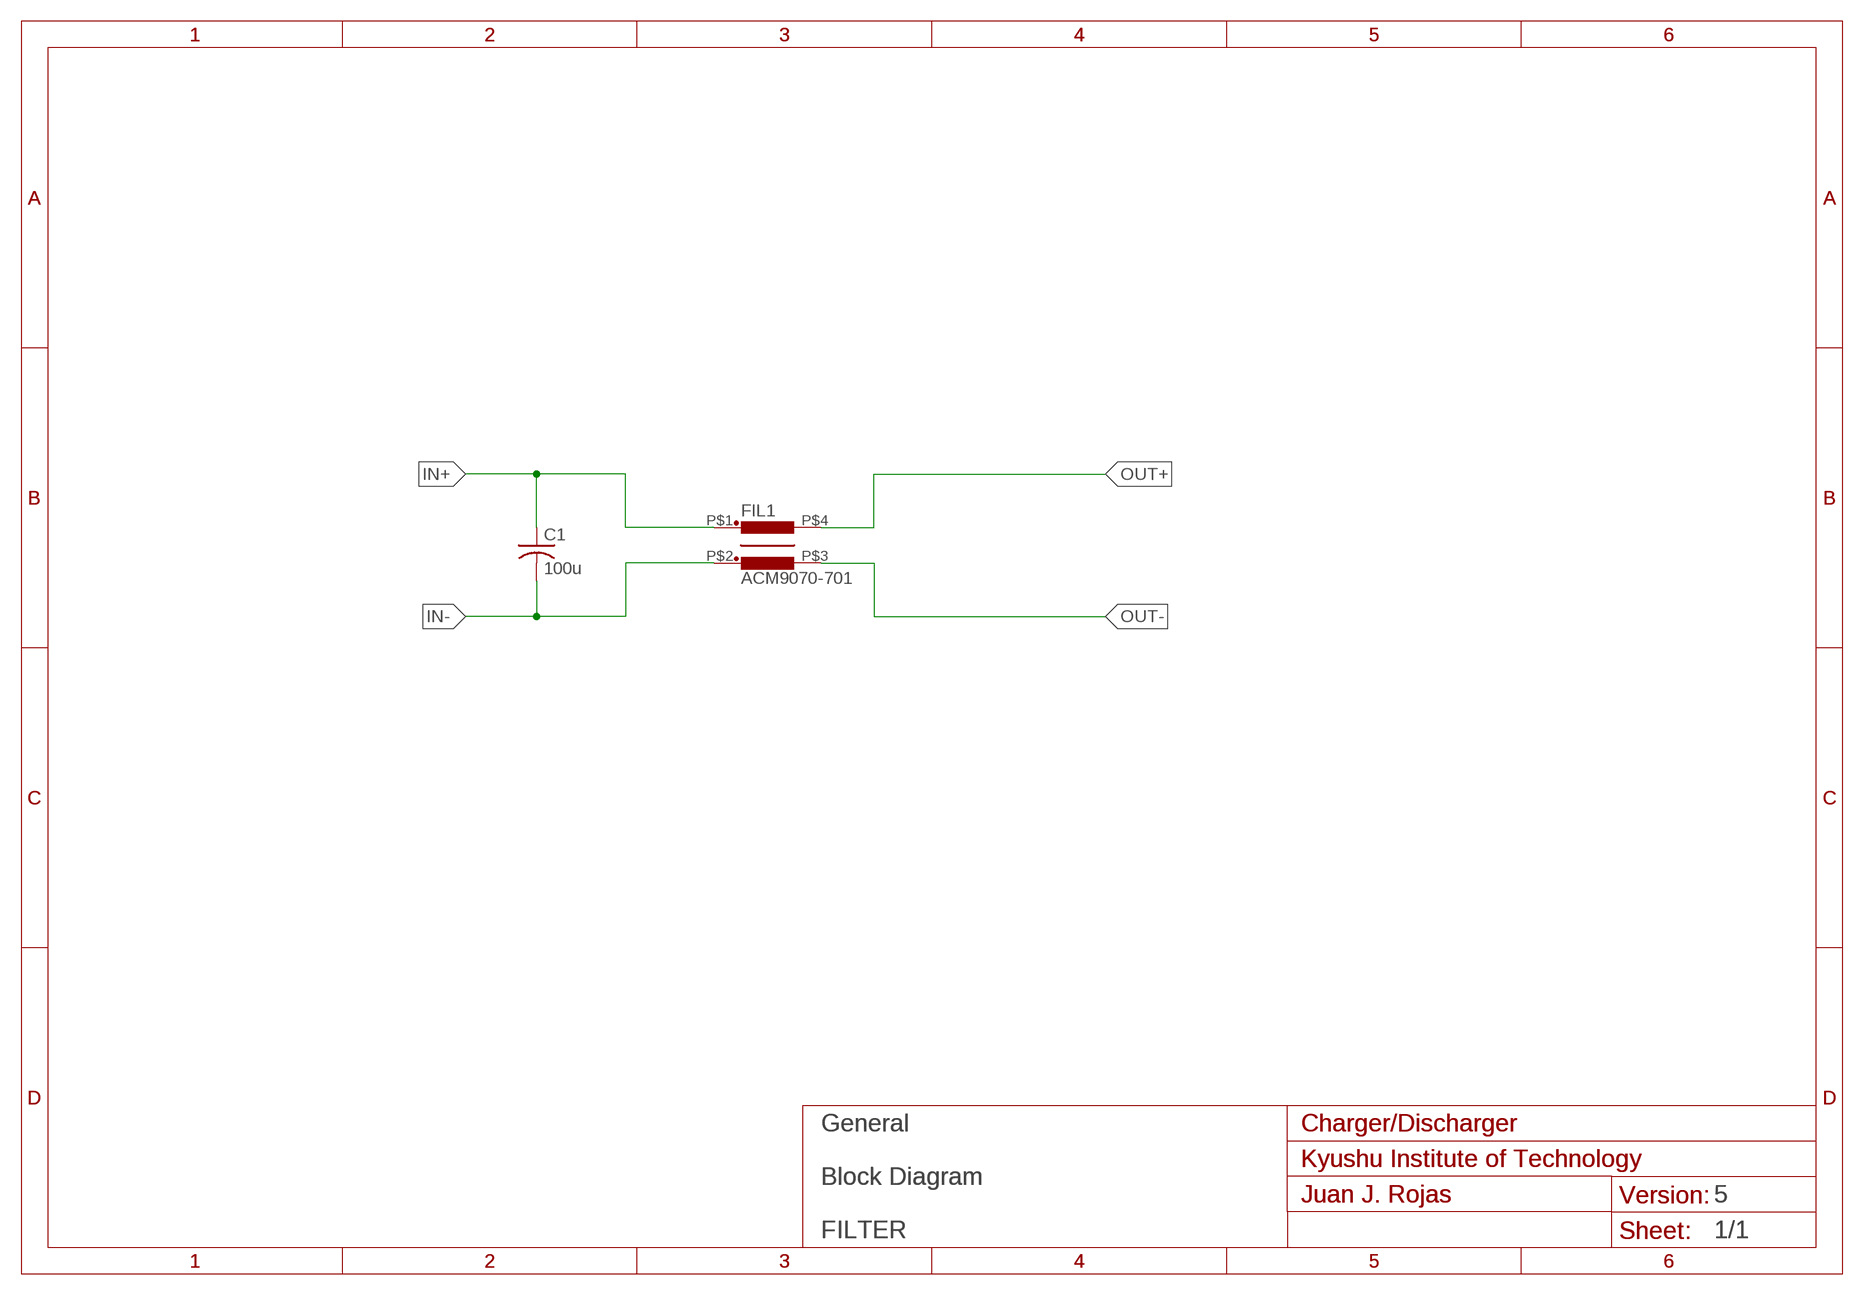
[diagram p7: schematic, module FILTER, sheet 1]
FRAME1 (A4L-JUANJO): SUBTITLE: Block Diagram; TITLE: General
FRAME2 (A4L-JUANJO): SUBTITLE: Block Diagram; TITLE: General

### Parts
C1  100u  POL_CAP-6.3D  [D6.3_AEC]
FIL1  ACM9070-701  [ACM9070-701]

### Nets
IN+: C1.POS FIL1.P$1(W1A)
IN-: C1.NEG FIL1.P$2(W2A)
OUT+: FIL1.P$4(W1E)
OUT-: FIL1.P$3(W2E)

### Library data of the parts
C1 = Pasives:POL_CAP
FIL1 = Pasives:ACM9070-701

## Module POWER_RESISTOR
Ports: POWERRES(io) REF(io)
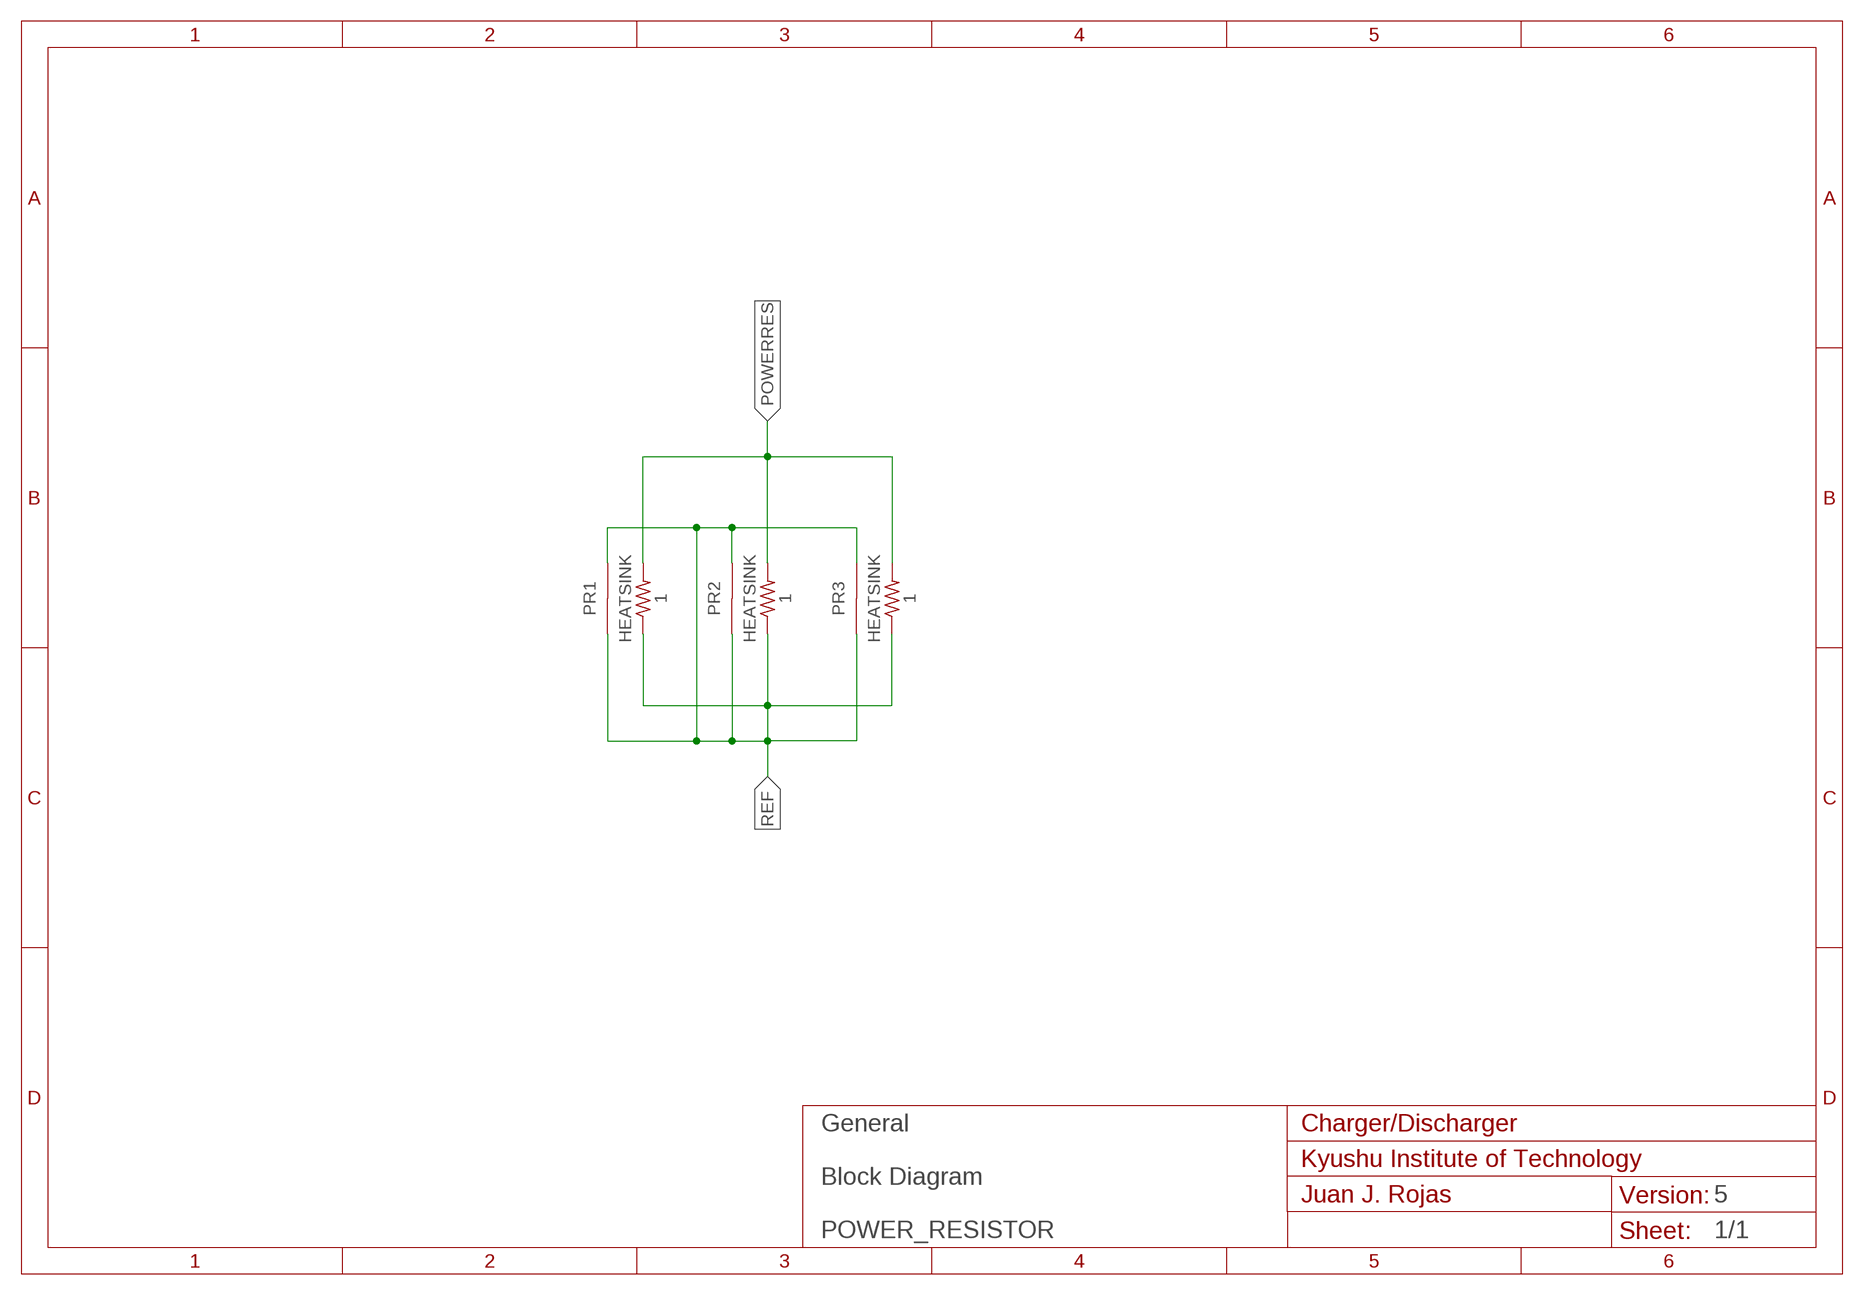
[diagram p8: schematic, module POWER_RESISTOR, sheet 1]
FRAME2 (A4L-JUANJO): SUBTITLE: Block Diagram; TITLE: General

### Parts
PR1  1  TO-220_RESISTOR  [TO-220HEATSINK]
PR2  1  TO-220_RESISTOR  [TO-220HEATSINK]
PR3  1  TO-220_RESISTOR  [TO-220HEATSINK]

### Nets
POWERRES: PR1.R2 PR2.R2 PR3.R2
REF: PR1.D1 PR1.D2 PR1.R1 PR2.D1 PR2.D2 PR2.R1 PR3.D1 PR3.D2 PR3.R1

### Library data of the parts
PR1-PR3 = Pasives:TO-220_RESISTOR